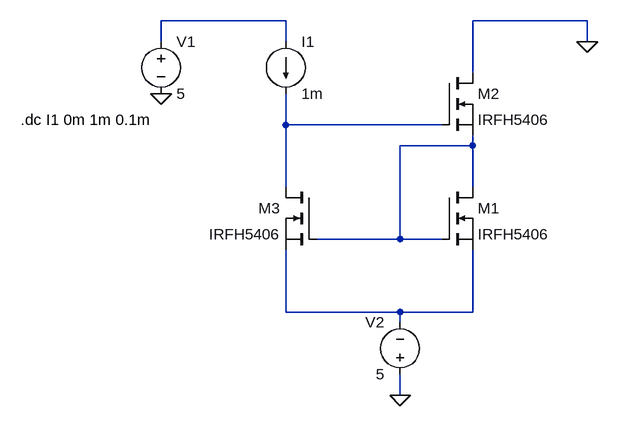
[diagram p0: schematic wilson_current_mirror.asc]
wilson_current_mirror.asc, the LTspice schematic file:
Version 4
SHEET 1 880 708
WIRE 64 64 -128 64
WIRE 528 64 352 64
WIRE -128 96 -128 64
WIRE 64 96 64 64
WIRE 528 96 528 64
WIRE 352 144 352 64
WIRE 64 224 64 176
WIRE 304 224 64 224
WIRE 352 256 352 240
WIRE 352 256 240 256
WIRE 64 320 64 224
WIRE 352 320 352 256
WIRE 240 400 240 256
WIRE 240 400 112 400
WIRE 304 400 240 400
WIRE 64 512 64 416
WIRE 240 512 64 512
WIRE 352 512 352 416
WIRE 352 512 240 512
WIRE 240 528 240 512
WIRE 240 640 240 608
FLAG -128 176 0
FLAG 240 640 0
FLAG 528 96 0
SYMBOL nmos 112 320 M0
SYMATTR InstName M3
SYMATTR Value IRFH5406
SYMBOL current 64 96 R0
WINDOW 123 0 0 Left 0
WINDOW 39 0 0 Left 0
SYMATTR InstName I1
SYMATTR Value 1m
SYMBOL voltage -128 80 R0
WINDOW 123 0 0 Left 0
WINDOW 39 0 0 Left 0
SYMATTR InstName V1
SYMATTR Value 5
SYMBOL voltage 240 624 R180
WINDOW 0 24 96 Left 2
WINDOW 3 24 16 Left 2
WINDOW 123 0 0 Left 0
WINDOW 39 0 0 Left 0
SYMATTR InstName V2
SYMATTR Value 5
SYMBOL nmos 304 320 R0
SYMATTR InstName M1
SYMATTR Value IRFH5406
SYMBOL nmos 304 144 R0
SYMATTR InstName M2
SYMATTR Value IRFH5406
TEXT -344 216 Left 2 !.dc I1 0m 1m 0.1m

The netlist it stands for:
* wilson_current_mirror.asc
M3 N002 N003 N004 N004 IRFH5406
I1 N001 N002 1m
V1 N001 0 5
V2 0 N004 5
M1 N003 N003 N004 N004 IRFH5406
M2 0 N002 N003 N003 IRFH5406
.model NMOS NMOS
.model PMOS PMOS
.lib standard.mos
.dc I1 0m 1m 0.1m
.backanno
.end